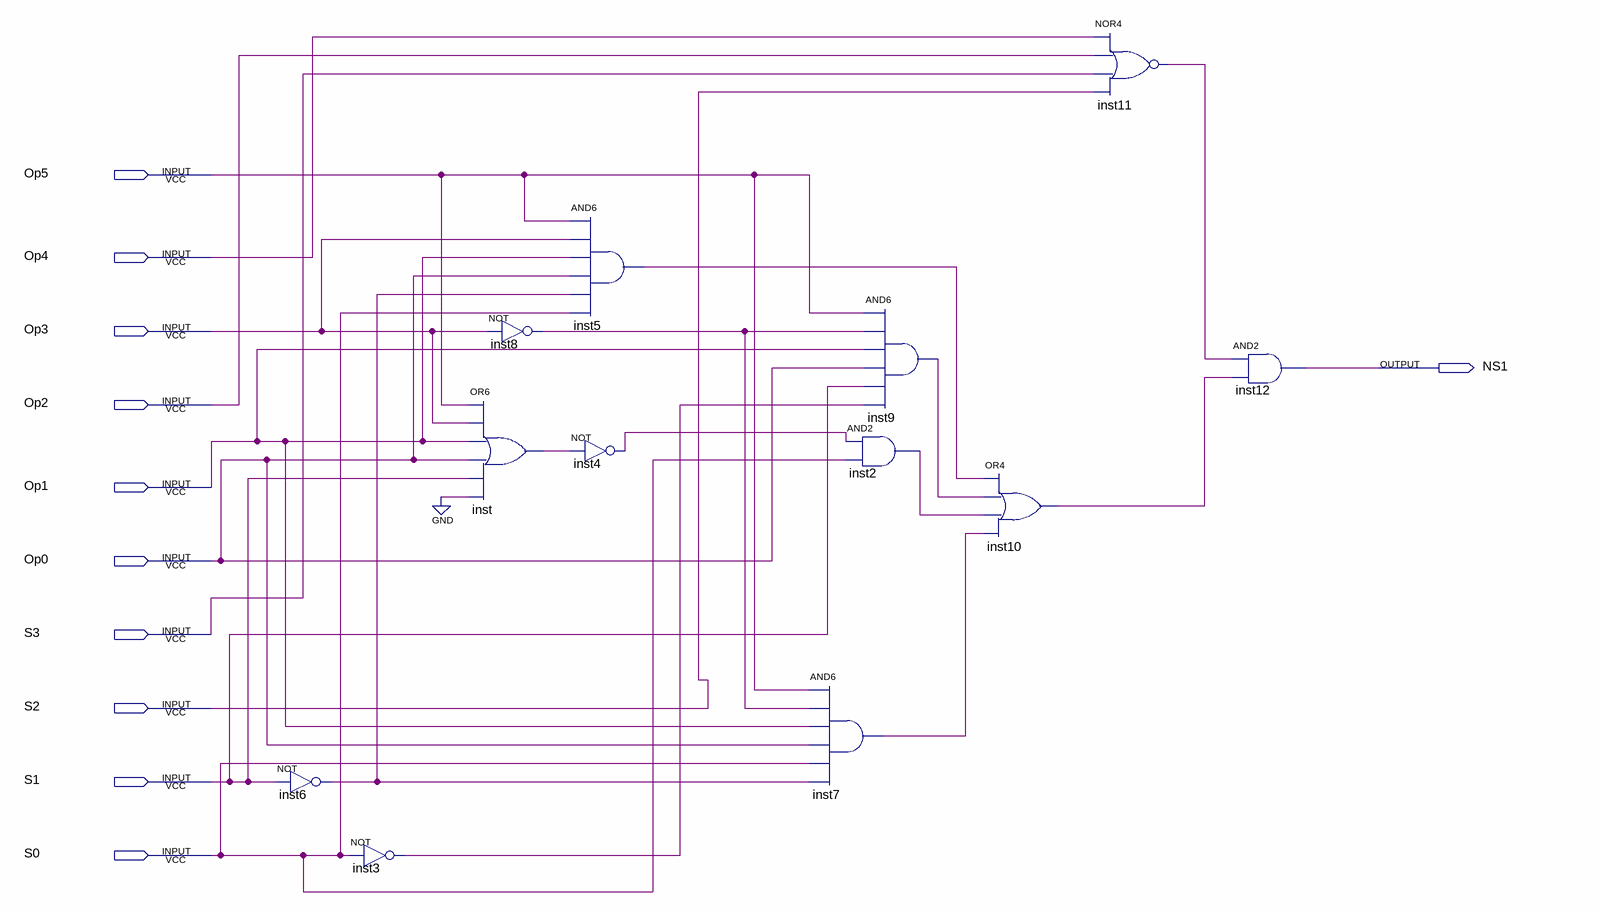
[diagram p0: schematic sheet]
// Quartus schematic NS1.bdf as structural Verilog: 12 symbols, 11 pins
module NS1 (
  input  Op5,
  input  Op4,
  input  Op3,
  input  Op2,
  input  Op1,
  input  Op0,
  input  S3,
  input  S2,
  input  S1,
  input  S0,
  output NS1
);

  wire inst2_out, inst3_out, inst4_out, inst5_out, inst6_out, inst7_out, inst8_out, inst9_out, inst10_out,
       inst11_out, inst_out;

  not inst6 (inst6_out, S1);
  not inst3 (inst3_out, S0);
  not inst8 (inst8_out, Op3);
  or inst (inst_out, Op5, Op3, Op1, Op0, S1, 1'b0);
  and inst5 (inst5_out, Op5, Op3, Op1, Op0, inst6_out, S0);
  not inst4 (inst4_out, inst_out);
  and inst9 (inst9_out, Op5, inst8_out, Op1, Op0, S1, inst3_out);
  and inst2 (inst2_out, inst4_out, S0);
  and inst7 (inst7_out, Op5, inst8_out, Op1, Op0, S0, inst6_out);
  or inst10 (inst10_out, inst5_out, inst9_out, inst2_out, inst7_out);
  nor inst11 (inst11_out, Op4, Op2, S3, S2);
  and inst12 (NS1, inst11_out, inst10_out);
endmodule
